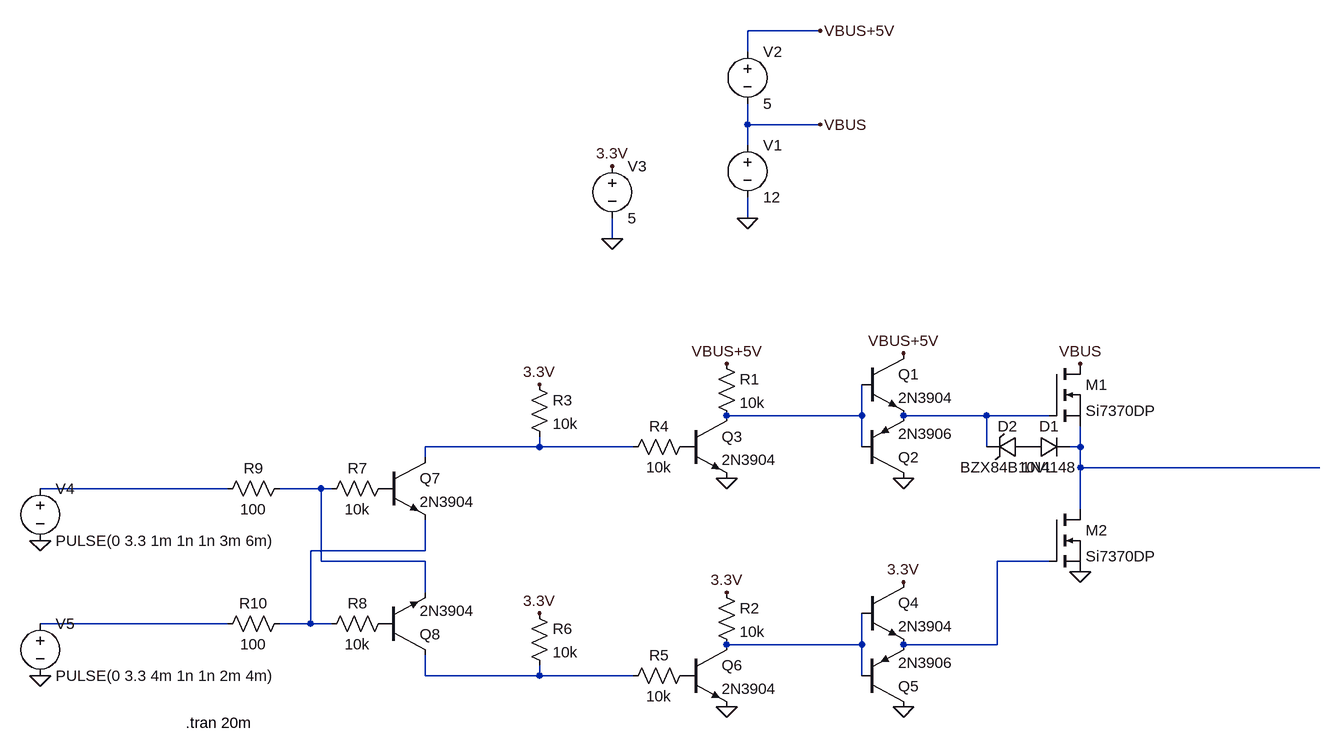
[diagram p0: schematic half_bridge.asc]
half_bridge.asc, the LTspice schematic file:
Version 4
SHEET 1 880 680
WIRE -256 -432 -368 -432
WIRE -368 -400 -368 -432
WIRE -368 -288 -368 -320
WIRE -256 -288 -368 -288
WIRE -368 -256 -368 -288
WIRE -368 -144 -368 -176
WIRE -576 -112 -576 -144
WIRE -192 160 -192 112
WIRE -192 160 -400 160
WIRE 0 160 -128 160
WIRE 96 160 0 160
WIRE -688 208 -688 192
WIRE -688 208 -864 208
WIRE -544 208 -688 208
WIRE -192 208 -192 160
WIRE 0 208 0 160
WIRE 144 208 144 176
WIRE 144 208 128 208
WIRE -864 224 -864 208
WIRE 144 240 144 208
WIRE 512 240 144 240
WIRE -1168 272 -1456 272
WIRE -1024 272 -1088 272
WIRE -1008 272 -1024 272
WIRE 144 304 144 240
WIRE -864 368 -864 320
WIRE -864 368 -1040 368
WIRE -1024 384 -1024 272
WIRE -864 384 -1024 384
WIRE 96 384 16 384
WIRE -864 432 -864 384
WIRE -1168 480 -1456 480
WIRE -1040 480 -1040 368
WIRE -1040 480 -1088 480
WIRE -1008 480 -1040 480
WIRE -192 512 -192 464
WIRE -192 512 -400 512
WIRE 16 512 16 384
WIRE 16 512 -128 512
WIRE -864 560 -864 528
WIRE -688 560 -688 544
WIRE -688 560 -864 560
WIRE -544 560 -688 560
WIRE -192 560 -192 512
FLAG -256 -288 VBUS
FLAG -256 -432 VBUS+5V
FLAG -368 -144 0
FLAG 144 80 VBUS
FLAG 144 400 0
FLAG -576 -112 0
FLAG -576 -224 3.3V
FLAG -128 256 0
FLAG -128 64 VBUS+5V
FLAG -400 80 VBUS+5V
FLAG -400 256 0
FLAG -128 608 0
FLAG -128 416 3.3V
FLAG -400 608 0
FLAG -400 432 3.3V
FLAG -688 464 3.3V
FLAG -688 112 3.3V
FLAG -1456 352 0
FLAG -1456 560 0
SYMBOL nmos 96 80 R0
SYMATTR InstName M1
SYMATTR Value Si7370DP
SYMBOL nmos 96 304 R0
SYMATTR InstName M2
SYMATTR Value Si7370DP
SYMBOL voltage -368 -272 R0
SYMATTR InstName V1
SYMATTR Value 12
SYMBOL voltage -368 -416 R0
SYMATTR InstName V2
SYMATTR Value 5
SYMBOL voltage -576 -240 R0
SYMATTR InstName V3
SYMATTR Value 5
SYMBOL npn -192 64 R0
SYMATTR InstName Q1
SYMATTR Value 2N3904
SYMBOL pnp -192 256 M180
SYMATTR InstName Q2
SYMATTR Value 2N3906
SYMBOL npn -464 160 R0
SYMATTR InstName Q3
SYMATTR Value 2N3904
SYMBOL res -416 64 R0
SYMATTR InstName R1
SYMATTR Value 10k
SYMBOL diode 64 224 R270
WINDOW 0 32 32 VTop 2
WINDOW 3 0 32 VBottom 2
SYMATTR InstName D1
SYMATTR Value 1N4148
SYMBOL zener 64 224 M270
WINDOW 0 32 32 VTop 2
WINDOW 3 0 32 VBottom 2
SYMATTR InstName D2
SYMATTR Value BZX84B10VL
SYMATTR Description Diode
SYMATTR Type diode
SYMBOL npn -192 416 R0
SYMATTR InstName Q4
SYMATTR Value 2N3904
SYMBOL pnp -192 608 M180
SYMATTR InstName Q5
SYMATTR Value 2N3906
SYMBOL npn -464 512 R0
SYMATTR InstName Q6
SYMATTR Value 2N3904
SYMBOL res -416 416 R0
SYMATTR InstName R2
SYMATTR Value 10k
SYMBOL res -704 96 R0
SYMATTR InstName R3
SYMATTR Value 10k
SYMBOL res -448 192 R90
WINDOW 0 0 56 VBottom 2
WINDOW 3 32 56 VTop 2
SYMATTR InstName R4
SYMATTR Value 10k
SYMBOL res -448 544 R90
WINDOW 0 0 56 VBottom 2
WINDOW 3 32 56 VTop 2
SYMATTR InstName R5
SYMATTR Value 10k
SYMBOL res -704 448 R0
SYMATTR InstName R6
SYMATTR Value 10k
SYMBOL npn -928 224 R0
SYMATTR InstName Q7
SYMATTR Value 2N3904
SYMBOL npn -928 528 M180
SYMATTR InstName Q8
SYMATTR Value 2N3904
SYMBOL res -912 256 R90
WINDOW 0 0 56 VBottom 2
WINDOW 3 32 56 VTop 2
SYMATTR InstName R7
SYMATTR Value 10k
SYMBOL res -912 464 R90
WINDOW 0 0 56 VBottom 2
WINDOW 3 32 56 VTop 2
SYMATTR InstName R8
SYMATTR Value 10k
SYMBOL voltage -1456 256 R0
WINDOW 123 0 0 Left 0
WINDOW 39 0 0 Left 0
SYMATTR InstName V4
SYMATTR Value PULSE(0 3.3 1m 1n 1n 3m 6m)
SYMBOL voltage -1456 464 R0
WINDOW 123 0 0 Left 0
WINDOW 39 0 0 Left 0
SYMATTR InstName V5
SYMATTR Value PULSE(0 3.3 4m 1n 1n 2m 4m)
SYMBOL res -1072 256 R90
WINDOW 0 0 56 VBottom 2
WINDOW 3 32 56 VTop 2
SYMATTR InstName R9
SYMATTR Value 100
SYMBOL res -1072 464 R90
WINDOW 0 0 56 VBottom 2
WINDOW 3 32 56 VTop 2
SYMATTR InstName R10
SYMATTR Value 100
TEXT -1232 632 Left 2 !.tran 20m

The netlist it stands for:
* half_bridge.asc
M1 VBUS N002 N004 N004 Si7370DP
M2 N004 N008 0 0 Si7370DP
V1 VBUS 0 12
V2 VBUS+5V VBUS 5
V3 3.3V 0 5
Q1 VBUS+5V N001 N002 0 2N3904
Q2 0 N001 N002 0 2N3906
Q3 N001 P001 0 0 2N3904
R1 VBUS+5V N001 10k
D1 P002 N004 1N4148
D2 P002 N002 BZX84B10VL
Q4 3.3V N010 N008 0 2N3904
Q5 0 N010 N008 0 2N3906
Q6 N010 P003 0 0 2N3904
R2 3.3V N010 10k
R3 3.3V N003 10k
R4 P001 N003 10k
R5 P003 N011 10k
R6 3.3V N011 10k
Q7 N003 P004 N007 0 2N3904
Q8 N011 P005 N006 0 2N3904
R7 P004 N006 10k
R8 P005 N007 10k
V4 N005 0 PULSE(0 3.3 1m 1n 1n 3m 6m)
V5 N009 0 PULSE(0 3.3 4m 1n 1n 2m 4m)
R9 N006 N005 100
R10 N007 N009 100
.model D D
.lib standard.dio
.model NPN NPN
.model PNP PNP
.lib standard.bjt
.model NMOS NMOS
.model PMOS PMOS
.lib standard.mos
.tran 20m
.backanno
.end